# Altium schematic sheet Simulation_PFC.SchDoc
size A4; SheetNumber: 1; SheetTotal: 1
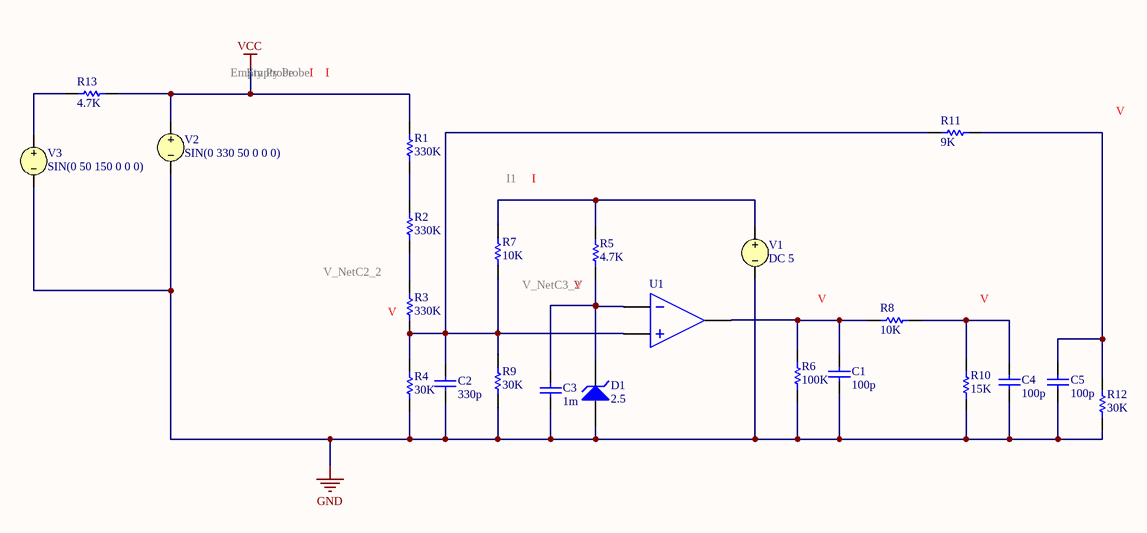
[diagram p0: Simulation_PFC.SchDoc]

## Parts
C1  value 100p  (hidden comment: Capacitor)
C2  value 330p  (hidden comment: Capacitor)
C3  value 1m  (hidden comment: Capacitor)
C4  value 100p  (hidden comment: Capacitor)
C5  value 100p  (hidden comment: Capacitor)
D1  BV: 2.5  (hidden comment: Zener Diode)
R1  value 330K  (hidden comment: Resistor)
R2  value 330K  (hidden comment: Resistor)
R3  value 330K  (hidden comment: Resistor)
R4  value 30K  (hidden comment: Resistor)
R5  value 4.7K  (hidden comment: Resistor)
R6  value 100K  (hidden comment: Resistor)
R7  value 10K  (hidden comment: Resistor)
R8  value 10K  (hidden comment: Resistor)
R9  value 30K  (hidden comment: Resistor)
R10  value 15K  (hidden comment: Resistor)
R11  value 9K  (hidden comment: Resistor)
R12  value 30K  (hidden comment: Resistor)
R13  value 4.7K  (hidden comment: Resistor)
U1  Ideal Comparator  (value not drawn)
V1  DC 5
V2  SIN(0 330 50 0 0 0)
V3  SIN(0 50 150 0 0 0)

## Nets
GND: C1.1 C2.1 C3.1 C4.1 C5.1 D1.1(A) R4.1 R6.1 R9.1 R10.1 R12.1 V1.2 V2.2 V3.2
VCC: R1.2 R13.1 V2.1
NetC1_2: C1.2 R6.2 R8.2 U1.3(OUT)
NetC2_2: C2.2 R3.1 R4.2 R7.1 R9.2 R11.2 U1.2(IN+)
NetC3_2: C3.2 D1.2(K) R5.1 U1.1(IN-)
NetC4_2: C4.2 R8.1 R10.2
NetC5_2: C5.2 R11.1 R12.2
NetR1_1: R1.1 R2.2
NetR2_1: R2.1 R3.2
NetR5_2: R5.2 R7.2 V1.1
NetR13_2: R13.2 V3.1

## Library data of the parts
C1-C5 = Capacitor: SimulationGenericComponent: True
D1 = Zener Diode: AF: 1; BV_MAX: 1e99; CJO: 0; EG: 1.11; FC: 0.5; IBV: 0.001; IS: 1e-14; MJSW: 0.33; NTUN: 30; TNOM: 27; XTI: 3; SimulationGenericComponent: True; Initial Voltage: 2.5; CJP: 0; CTA: 0; CTP: 0; FCS: 0.5; FV_MAX: 1e99; IKF: 0; IKR: 0; ISR: 1e-14; JSW: 0; JTUN: 0; JTUNSW: 0; KEG: 1; KF: 0; LEVEL: 1; N: 1; NBV: 1; NR: 1; NS: 1; PHP: 1; RS: 0; TCV: 0; TLEV: 0; TLEVC: 0; TM1: 0; TM2: 0; TPB: 0; TPHP: 0; TRS: 0; TRS2: 0; TT: 0; TTT1: 0; TTT2: 0; VJ: 1; XTITUN: 3
R1-R13 = Resistor: TC1: 0; SimulationGenericComponent: True; TC2: 0
U1 = Comparator: VHIGH: 5; VLOW: 100m; VHYS: 50m; SimulationGenericComponent: True
V1 = VSRC: Voltage Source; Note: PCB Footprint - Not required; AC Magnitude: 1; AC Phase: 0; Value: 5; Published: 8-Jun-2000; LatestRevisionDate: 17-Jul-2002; LatestRevisionNote: Re-released for DXP Platform.; PackageReference: Not Applicable; Publisher: Altium Limited
V2 = VSRC: Voltage Source; Note: PCB Footprint - Not required; AC Magnitude: 0; Amplitude: 330; Frequency: 50; Published: 8-Jun-2000; LatestRevisionDate: 17-Jul-2002; LatestRevisionNote: Re-released for DXP Platform.; PackageReference: Not Applicable; Publisher: Altium Limited; AC Phase: 0; DC Magnitude: 0; Offset: 0; Delay: 0; Damping Factor: 0; Phase: 0
V3 = VSRC: Voltage Source; Note: PCB Footprint - Not required; AC Magnitude: 50; AC Phase: 0; Frequency: 150; Published: 8-Jun-2000; LatestRevisionDate: 17-Jul-2002; LatestRevisionNote: Re-released for DXP Platform.; PackageReference: Not Applicable; Publisher: Altium Limited; DC Magnitude: 50; Offset: 0; Amplitude: 50; Delay: 0; Damping Factor: 0; Phase: 0